# Altium schematic sheet DPPXHK_LEDs.SCHDOC
size A4
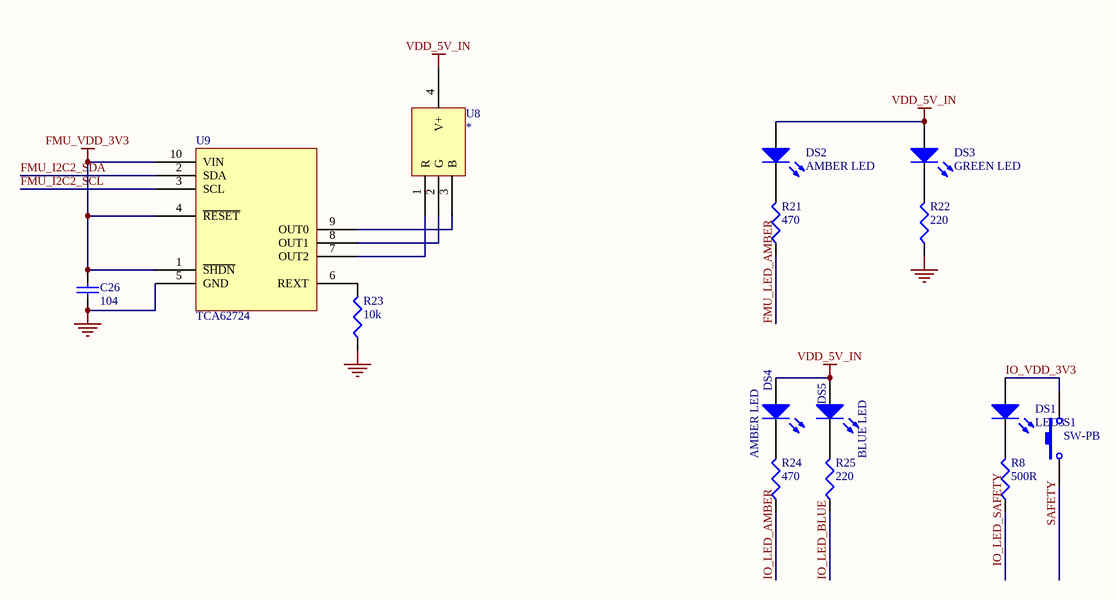
[diagram p0: DPPXHK_LEDs.SCHDOC]

## Parts
C26  104  [LC0402]
DS1  LED3  [0603_diode]
DS2  AMBER LED  [0603_diode]
DS3  GREEN LED  [0603_diode]
DS4  AMBER LED  [0603_diode]
DS5  BLUE LED  [0603_diode]
R8  500R  [0402R]
R21  470  [0402R]
R22  220  [0402R]
R23  10k  [0402R]
R24  470  [0402R]
R25  220  [0402R]
S1  SW-PB  [BUTTON-3*6]
U8  *  [LEDRGB]
U9  TCA62724  [SON10]

## Nets
FMU_VDD_3V3: C26.2 U9.1(~{SHDN}) U9.4(~{RESET}) U9.10(VIN)
GND: C26.1 R22.1 R23.1 U9.5(GND)
VDD_5V_IN: DS2.1(A) DS3.1(A) DS4.1(A) DS5.1(A) U8.4(V+)
FMU_I2C2_SCL: U9.3(SCL)
FMU_I2C2_SDA: U9.2(SDA)
FMU_LED_AMBER: R21.1
IO_LED_AMBER: R24.1
IO_LED_BLUE: R25.1
IO_LED_SAFETY: R8.1
IO_VDD_3V3: DS1.1(A) S1.2
SAFETY: S1.1
NetDS1_2: DS1.2(K) R8.2
NetDS2_2: DS2.2(K) R21.2
NetDS3_2: DS3.2(K) R22.2
NetDS4_2: DS4.2(K) R24.2
NetDS5_2: DS5.2(K) R25.2
NetR23_2: R23.2 U9.6(REXT)
NetU8_1: U8.1(R) U9.7(OUT2)
NetU8_2: U8.2(G) U9.8(OUT1)
NetU8_3: U8.3(B) U9.9(OUT0)

## Library data of the parts
C26 = Cap Semi: Capacitor (Semiconductor SIM Model); Published: 8-Jun-2000; LatestRevisionDate: 17-Jul-2002; LatestRevisionNote: Re-released for DXP Platform.; PackageReference: C1206; Publisher: Altium Limited
DS1-DS5 = LED3: Typical BLUE SiC LED; Published: 8-Jun-2000; LatestRevisionDate: 17-Dec-2003; LatestRevisionNote: PCB Footprint replaced.; Publisher: Altium Limited
R8 R21-R25 = Res3: Resistor; Published: 8-Jun-2000; LatestRevisionDate: 4-Mar-2005; LatestRevisionNote: PCB Footprint replaced.; Publisher: Altium Limited
S1 = SW-PB: Switch; Published: 24-Mar-1999; LatestRevisionDate: 17-Jul-2002; LatestRevisionNote: Re-released for DXP Platform.; Publisher: Altium Limited
U8 = LED_RGB